# EAGLE schematic MicroMod_Multipurpose_CarrierBoard (EAGLE 9.6.2)

## Sheet 1 of 2
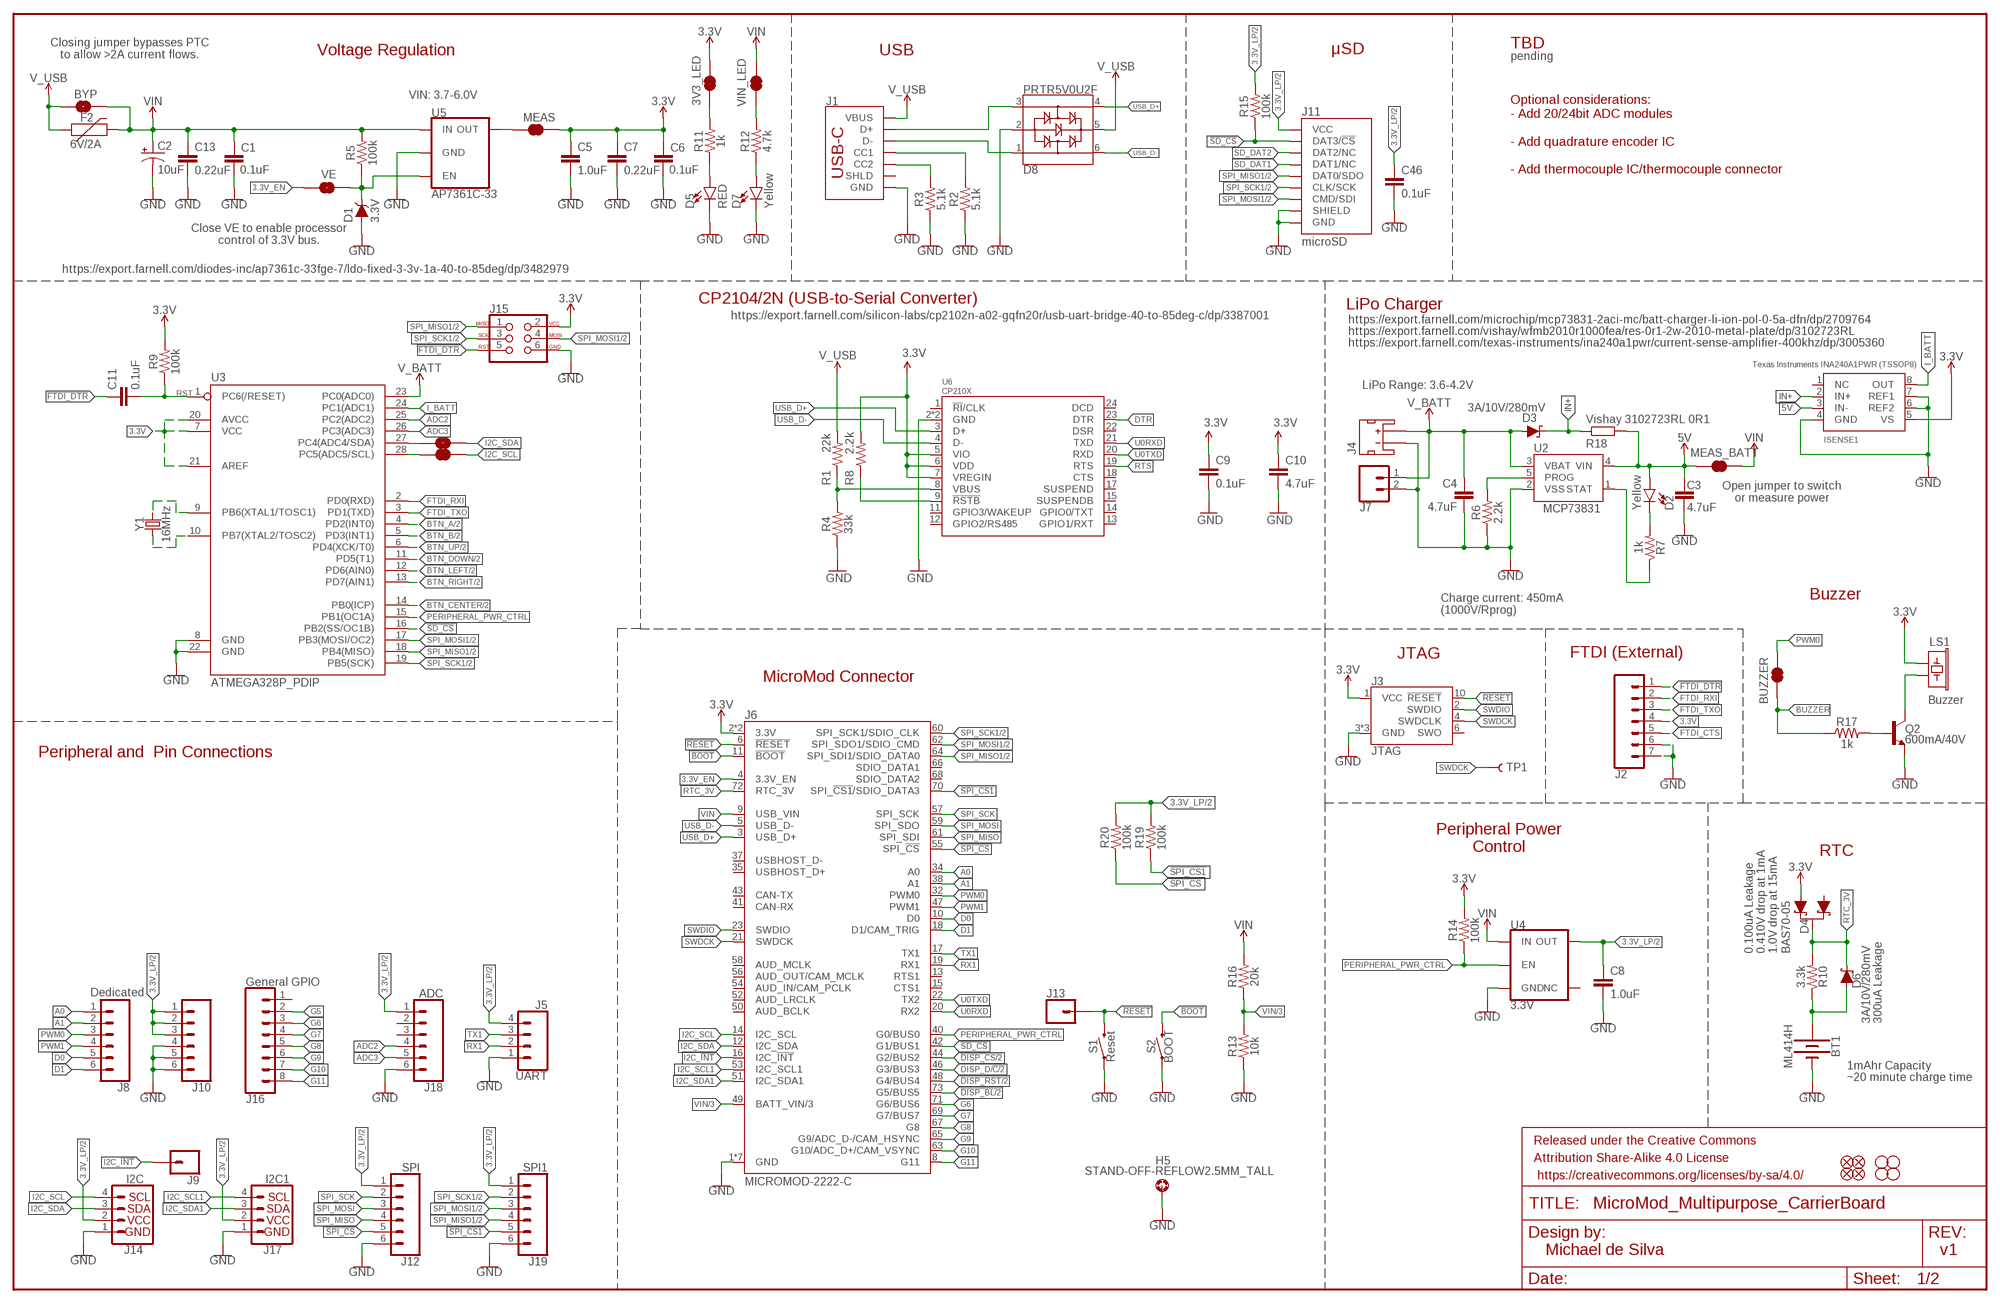
[diagram p0: schematic, sheet 1]

### Parts
3V3_LED  JUMPER-SMT_2_NC_TRACE_SILK  [SMT-JUMPER_2_NC_TRACE_SILK]
BT1  ML414H  ML414H_IV01E_BATTERY  [ML414H_IV01E]
BUZZER  JUMPER-COMBO_2_NC_TRACE  [COMBO-JUMPER_2_NC_TRACE]
BYP  JUMPER-SMT_2_NO_SILK  [SMT-JUMPER_2_NO_SILK]
C1  0.1uF  0.1UF-0603-25V-(+80/-20%)  [0603]
C2  10uF  10UF-POLAR-EIA3216-16V-10%(TANT)  [EIA3216]
C3  4.7uF  4.7UF-0603-35V-(20%)  [0603]
C4  4.7uF  4.7UF-0603-6.3V-(10%)  [0603]
C5  1.0uF  1.0UF-0603-16V-10%  [0603]
C6  0.1uF  0.1UF-0603-25V-(+80/-20%)  [0603]
C7  0.22uF  0.22UF-0603-25V-10%  [0603]
C8  1.0uF  1.0UF-0603-16V-10%  [0603]
C9  0.1uF  0.1UF-0402T-16V-10%  [0402-TIGHT]
C10  4.7uF  4.7UF-0402_TIGHT-6.3V-20%-X5R  [0402-TIGHT]
C11  0.1uF  0.1UF-0603-25V-5%  [0603]
C13  0.22uF  0.22UF-0603-25V-10%  [0603]
C46  0.1uF  0.1UF-0603-25V-(+80/-20%)  [0603]
D1  3.3V  DIODE-ZENER-MM3Z3V3T1G  [SOD-323]
D2  Yellow  LED-YELLOW0603  [LED-0603]
D3  3A/10V/280mV  DIODE-SCHOTTKY-BAT60A  [SOD-323]
D4  BAS70-05  DIODE-SCHOTTKY-DUAL  [SOT23-3]
D5  RED  LED-RED0603  [LED-0603]
D6  3A/10V/280mV  DIODE-SCHOTTKY-BAT60A  [SOD-323]
D7  Yellow  LED-YELLOW0603  [LED-0603]
D8  PRTR5V0U2F  [SOT886]
F2  6V/2A  PPTC_6V2A  [1210]
FD1  FIDUCIALUFIDUCIAL  [FIDUCIAL-MICRO]
FD2  FIDUCIALUFIDUCIAL  [FIDUCIAL-MICRO]
FD3  FIDUCIALUFIDUCIAL  [FIDUCIAL-MICRO]
FD4  FIDUCIALUFIDUCIAL  [FIDUCIAL-MICRO]
FRAME1  FRAME-LEDGER  [CREATIVE_COMMONS]
H1  STAND-OFF  [STAND-OFF]
H2  STAND-OFF  [STAND-OFF]
H3  STAND-OFF  [STAND-OFF]
H4  STAND-OFF  [STAND-OFF]
H5  STAND-OFF-REFLOW2.5MM_TALL  [STAND-OFF-REFLOW-M2.5]
I2C_SCL  JUMPER-COMBO_2_NC_TRACE  [COMBO-JUMPER_2_NC_TRACE]
I2C_SDA  JUMPER-COMBO_2_NC_TRACE  [COMBO-JUMPER_2_NC_TRACE]
ISENSE1  Texas Instruments INA240A1PWR (TSSOP8)  IN240ATSSOP8  [TSSOP8]
J1  USB_C_2-LAYER_PADS  [USB-C-16P-2LAYER-PADS]
J2  CONN_07  [1X07]
J3  JTAG  CORTEX_JTAG_DEBUG_MINIMUM_PTH  [2X5-PTH-1.27MM]
J4  JST_2MM_MALE  [JST-2-SMD]
J5  UART  CONN_041X04_NO_SILK  [1X04_NO_SILK]
J6  MICROMOD-2222-C  [M.2-CONNECTOR-E]
J7  CONN_021X02_NO_SILK  [1X02_NO_SILK]
J8  Dedicated  CONN_06NO_SILK_NO_POP  [1X06_NO_SILK]
J9  CONN_01PTH_NO_SILK_YES_STOP  [1X01_NO_SILK]
J10  CONN_06NO_SILK_NO_POP  [1X06_NO_SILK]
J11  microSD  MICRO-SD-SDIOPUSH-PUSH  [MICRO-SD-SOCKET]
J12  SPI  CONN_06NO_SILK_NO_POP  [1X06_NO_SILK]
J13  CONN_01PTH_NO_SILK_YES_STOP  [1X01_NO_SILK]
J14  I2C  I2C_STANDARD_NO_SILK  [1X04_NO_SILK]
J15  AVR_SPI_PROG_3X2TESTPOINTS  [2X3_TEST_POINTS]
J16  General GPIO  CONN_08"  [1X08]
J17  I2C1  I2C_STANDARD_NO_SILK  [1X04_NO_SILK]
J18  ADC  CONN_06NO_SILK_NO_POP  [1X06_NO_SILK]
J19  SPI1  CONN_06NO_SILK_NO_POP  [1X06_NO_SILK]
LS1  Buzzer  BUZZER-SMD  [BUZZER-CCV]
MEAS  JUMPER-COMBO_2_NC_TRACE  [COMBO-JUMPER_2_NC_TRACE]
MEAS_BATT  JUMPER-COMBO_2_NC_TRACE  [COMBO-JUMPER_2_NC_TRACE]
Q2  600mA/40V  TRANS_NPN-MMBT2222AL  [SOT23-3]
R1  22k  22KOHM-0402_TIGHT-1/10W-1%  [0402-TIGHT]
R2  5.1k  5.1KOHM5.1KOHM-0603-1/10W-1%  [0603]
R3  5.1k  5.1KOHM5.1KOHM-0603-1/10W-1%  [0603]
R4  33k  33KOHM-0402T-1/16W-1%  [0402-TIGHT]
R5  100k  100KOHM-0603-1/10W-1%  [0603]
R6  2.2k  2.2KOHM-0603-1/10W-1%  [0603]
R7  1k  1KOHM-0603-1/10W-1%  [0603]
R8  2.2k  2.2KOHM-0402T-1/16W-1%  [0402-TIGHT]
R9  100k  100KOHM-0603-1/10W-1%  [0603]
R10  3.3k  3.3KOHM-0603-1/10W-1%  [0603]
R11  1k  1KOHM-0603-1/10W-1%  [0603]
R12  4.7k  4.7KOHM-0603-1/10W-1%  [0603]
R13  10k  10KOHM-0603-1/10W-1%  [0603]
R14  100k  100KOHM-0603-1/10W-1%  [0603]
R15  100k  100KOHM-0603-1/10W-1%  [0603]
R16  20k  20KOHM-0603-1/10W-1%  [0603]
R17  1k  1KOHM-0603-1/10W-1%  [0603]
R18  Vishay 3102723RL 0R1  R-EU_R5025  [R5025]
R19  100k  100KOHM-0603-1/10W-1%  [0603]
R20  100k  100KOHM-0603-1/10W-1%  [0603]
S1  Reset  MOMENTARY-SWITCH-SPST-SMD-5.2-TALL-REDUNDANT  [TACTILE_SWITCH_SMD_5.2MM]
S2  BOOT  MOMENTARY-SWITCH-SPST-SMD-5.2-TALL-REDUNDANT  [TACTILE_SWITCH_SMD_5.2MM]
TP1  TEST-POINT3  [PAD.03X.03]
U2  MCP73831  [SOT23-5]
U3  ATMEGA328P_PDIP  [DIP28]
U4  3.3V  V_REG_AP2112K-3.3V  [SOT23-5]
U5  AP7361C-33  AP7361C-33FGEUDFN-8  [UDFN-8]
U6  CP210X  CP2102N  [QFN24]
VE  JUMPER-SMT_2_NO_SILK  [SMT-JUMPER_2_NO_SILK]
VIN_LED  JUMPER-SMT_2_NC_TRACE_SILK  [SMT-JUMPER_2_NC_TRACE_SILK]
Y1  16MHz  CRYSTAL-16MHZPTH-HC49US  [HC49US]

### Nets
3.3V: 3V3_LED.2 C5.1 C6.1 C7.1 C9.1 C10.1 D4.2(A1) ISENSE1.5(VS) J2.4 J3.1(VCC) J6.2(3.3V) J6.74(3.3V) J15.2 LS1.+ MEAS.2 MEAS.4 R8.2 R9.2 R14.2 U3.7(VCC) U3.20(AVCC) U3.21(AREF) U6.5(VIO) U6.6(VDD) U6.7(VREGIN) ; also sheet 2
3.3V_EN: J6.4(3.3V_EN) VE.1
3.3V_EN_VE: D1.C R5.1 U5.5(EN) VE.2
3.3V_LP: C8.1 C46.1 J5.4 J10.1 J10.2 J10.3 J11.VCC J12.1 J14.2 J17.2 J18.1 J19.1 R15.2 R19.2 R20.2 U4.5(OUT) ; also sheet 2
5V: C3.1 D2.A ISENSE1.3(IN-) MEAS_BATT.1 MEAS_BATT.3 R18.2 U2.4(VIN)
!BOOT!: J6.11(!BOOT!) S2.3 S2.4
!DISP_BL: J6.73(G5/BUS5) ; also sheet 2
!DISP_CS: J6.44(G2/BUS2) ; also sheet 2
!DISP_RST: J6.48(G4/BUS4) ; also sheet 2
!FTDI_DTR: C11.1 J2.1 J15.5
!RESET!: J3.10(!RESET) J6.6(!RESET!) J13.1 S1.3 S1.4
!SD_CS!: J6.42(G1/BUS1) J11.CS/DAT3(DAT3/!CS!) R15.1 U3.16(PB2(SS/OC1B))
!SPI_CS1!: J6.70(SPI_!CS1!/SDIO_DATA3) J19.5 R19.1
!SPI_CS!: J6.55(SPI_!CS!) J12.5 R20.1
A0: J6.34(A0) J8.1
A1: J6.38(A1) J8.2
ADC2: J18.4 U3.25(PC2(ADC2))
ADC3: J18.5 U3.26(PC3(ADC3))
BTN_A: U3.4(PD2(INT0)) ; also sheet 2
BTN_B: U3.5(PD3(INT1)) ; also sheet 2
BTN_CENTER: U3.14(PB0(ICP)) ; also sheet 2
BTN_DOWN: U3.11(PD5(T1)) ; also sheet 2
BTN_LEFT: U3.12(PD6(AIN0)) ; also sheet 2
BTN_RIGHT: U3.13(PD7(AIN1)) ; also sheet 2
BTN_UP: U3.6(PD4(XCK/T0)) ; also sheet 2
BUZZER: BUZZER.1 BUZZER.3 R17.1
CHG_LED: R7.1 U2.1(STAT)
D0: J6.10(D0) J8.5
D1: J6.18(D1/CAM_TRIG) J8.6
DISP_D/!C: J6.46(G3/BUS3) ; also sheet 2
DTR: U6.23(DTR)
FTDI_CTS: J2.5
FTDI_RXI: J2.2 U3.2(PD0(RXD))
FTDI_TXO: J2.3 U3.3(PD1(TXD))
G5: J16.2
G6: J6.71(G6/BUS6) J16.3
G7: J6.69(G7/BUS7) J16.4
G8: J6.67(G8) J16.5
G9: J6.65(G9/ADC_D-/CAM_HSYNC) J16.6
G10: J6.63(G10/ADC_D+/CAM_VSYNC) J16.7
G11: J6.8(G11) J16.8
GND: BT1.- C1.2 C2.- C3.2 C4.2 C5.2 C6.2 C7.2 C8.2 C9.2 C10.2 C13.2 C46.2 D1.A D5.C D7.C D8.2 H5.1 ISENSE1.4(GND) ISENSE1.6(REF2) ISENSE1.7(REF1) J1.GND J1.GND2(GND) J2.6 J2.7 J3.3(GND) J3.5(GND) J3.9(GND) J4.1(-) J5.1 J6.1(GND) J6.7(GND) J6.33(GND) J6.36(GND) J6.39(GND) J6.45(GND) J6.75(GND) J7.2 J10.4 J10.5 J10.6 J11.CD1(SHIELD) J11.GND J11.GND1(GND) J11.GND3(GND) J12.6 J14.1 J15.6 J17.1 J18.6 J19.6 Q2.2(E) R2.1 R3.1 R4.1 R6.1 R13.1 S1.1 S1.2 S2.1 S2.2 U2.2(VSS) U3.8(GND) U3.22(GND) U4.2(GND) U5.4(GND) U5.EP(GND) U6.2(GND) U6.PAD(GND) ; also sheet 2
I2C_!INT!: J6.16(I2C_!INT!) J9.1
I2C_SCL: I2C_SCL.1 I2C_SCL.3 J6.14(I2C_SCL) J14.4
I2C_SCL1: J6.53(I2C_SCL1) J17.4
I2C_SDA: I2C_SDA.2 I2C_SDA.4 J6.12(I2C_SDA) J14.3
I2C_SDA1: J6.51(I2C_SDA1) J17.3
I_BATT: ISENSE1.8(OUT) U3.24(PC1(ADC1))
IN+: D3.C ISENSE1.2(IN+) R18.1
N$1: MEAS.1 MEAS.3 U5.1(OUT)
N$2: U3.9(PB6(XTAL1/TOSC1)) Y1.2
N$3: U3.10(PB7(XTAL2/TOSC2)) Y1.1
N$4: D2.C R7.2
N$5: D5.A R11.1
N$6: 3V3_LED.1 R11.2
N$7: R6.2 U2.5(PROG)
N$8: R12.2 VIN_LED.1
N$9: D7.A R12.1
N$10: J1.A5(CC1) R2.2
N$11: J1.B5(CC2) R3.2
N$12: R1.1 R4.2 U6.8(VBUS)
N$13: R8.1 U6.9(!RSTB)
N$14: BT1.+ D6.A R10.1
N$15: LS1.- Q2.3(C)
N$16: Q2.1(B) R17.2
N$17: I2C_SDA.1 I2C_SDA.3 U3.27(PC4(ADC4/SDA))
N$18: I2C_SCL.2 I2C_SCL.4 U3.28(PC5(ADC5/SCL))
N$23: D8.1 J1.A7(D-) J1.B7(D-)
N$24: D8.3 J1.A6(D+) J1.B6(D+)
PERIPHERAL_PWR_CTRL: J6.40(G0/BUS0) R14.1 U3.15(PB1(OC1A)) U4.3(EN)
PWM0: BUZZER.2 BUZZER.4 J6.32(PWM0) J8.3
PWM1: J6.47(PWM1) J8.4
RST: C11.2 R9.1 U3.1(PC6(/RESET))
RTC_3V: D4.3(C) D6.C J6.72(RTC_3V) R10.2
RTS: U6.19(RTS)
RX1: J5.2 J6.19(RX1)
SD_DAT1: J11.DAT1(DAT1/NC)
SD_DAT2: J11.DAT2(DAT2/NC)
SPI_MISO: J6.61(SPI_SDI) J12.4
SPI_MISO1: J6.64(SPI_SDI1/SDIO_DATA0) J11.DO/DAT0(DAT0/SDO) J15.1 J19.4 U3.18(PB4(MISO)) ; also sheet 2
SPI_MOSI: J6.59(SPI_SDO) J12.3
SPI_MOSI1: J6.62(SPI_SDO1/SDIO_CMD) J11.DI/CMD(CMD/SDI) J15.4 J19.3 U3.17(PB3(MOSI/OC2)) ; also sheet 2
SPI_SCK: J6.57(SPI_SCK) J12.2
SPI_SCK1: J6.60(SPI_SCK1/SDIO_CLK) J11.SCLK(CLK/SCK) J15.3 J19.2 U3.19(PB5(SCK)) ; also sheet 2
SWDCK: J3.4(SWDCLK) J6.21(SWDCK) TP1.P$1
SWDIO: J3.2(SWDIO) J6.23(SWDIO)
TX1: J5.3 J6.17(TX1)
U0RXD: J6.20(RX2) U6.21(TXD)
U0TXD: J6.22(TX2) U6.20(RXD)
USB_D+: D8.4 J6.3(USB_D+) U6.3(D+)
USB_D-: D8.6 J6.5(USB_D-) U6.4(D-)
V_BATT: C4.1 D3.A J4.2(+) J7.1 U2.3(VBAT) U3.23(PC0(ADC0))
V_USB: BYP.1 D8.5 F2.1 J1.VBUS1(VBUS) J1.VBUS2(VBUS) R1.2
VIN: BYP.2 C1.1 C2.+ C13.1 F2.2 J6.9(USB_VIN) MEAS_BATT.2 MEAS_BATT.4 R5.2 R16.2 U4.1(IN) U5.8(IN) VIN_LED.2
VIN/3: J6.49(BATT_VIN/3) R13.2 R16.1
Unconnected: D4.1(A) ISENSE1.1(NC) J1.SHLD1(SHLD) J1.SHLD2(SHLD) J1.SHLD3(SHLD) J1.SHLD4(SHLD) J3.6(SWO) J4.NC1(PAD1) J4.NC2(PAD2) J6.13(RTS1) J6.15(CTS1) J6.35(USBHOST_D+) J6.37(USBHOST_D-) J6.41(CAN-RX) J6.43(CAN-TX) J6.50(AUD_BCLK) J6.52(AUD_LRCLK) J6.54(AUD_IN/CAM_PCLK) J6.56(AUD_OUT/CAM_MCLK) J6.58(AUD_MCLK) J6.66(SDIO_DATA1) J6.68(SDIO_DATA2) J16.1 J18.2 J18.3 U4.4(NC) U6.1(!RI!/CLK) U6.11(GPIO3/WAKEUP) U6.12(GPIO2/RS485) U6.13(GPIO1/RXT) U6.14(GPIO0/TXT) U6.15(SUSPENDB) U6.17(SUSPEND) U6.18(CTS) U6.22(DSR) U6.24(DCD)

### Notes on the sheet
- Closing jumper bypasses PTC
  to allow >2A current flows.
- Voltage Regulation | USB | μSD | TBD
- pending
- VIN: 3.7-6.0V
- Optional considerations:
  - Add 20/24bit ADC modules
  
  - Add quadrature encoder IC
  
  - Add thermocouple IC/thermocouple connector
- Close VE to enable processor
  control of 3.3V bus.
- https://export.farnell.com/diodes-inc/ap7361c-33fge-7/ldo-fixed-3-3v-1a-40-to-85deg/dp/3482979
- CP2104/2N (USB-to-Serial Converter) | LiPo Charger
- https://export.farnell.com/silicon-labs/cp2102n-a02-gqfn20r/usb-uart-bridge-40-to-85deg-c/dp/3387001 | https://export.farnell.com/microchip/mcp73831-2aci-mc/batt-charger-li-ion-pol-0-5a-dfn/dp/2709764
- https://export.farnell.com/vishay/wfmb2010r1000fea/res-0r1-2w-2010-metal-plate/dp/3102723RL
- https://export.farnell.com/texas-instruments/ina240a1pwr/current-sense-amplifier-400khz/dp/3005360
- LiPo Range: 3.6-4.2V
- Open jumper to switch
  or measure power
- Charge current: 450mA
  (1000V/Rprog)
- Buzzer
- JTAG | FTDI (External)
- MicroMod Connector
- Peripheral and  Pin Connections
- Peripheral Power
  Control
- RTC
- 0.100uA Leakage
  0.410V drop at 1mA
  1.0V drop at 15mA
- 300uA Leakage
- 1mAhr Capacity
- ~20 minute charge time
- Michael de Silva | v1

## Sheet 2 of 2
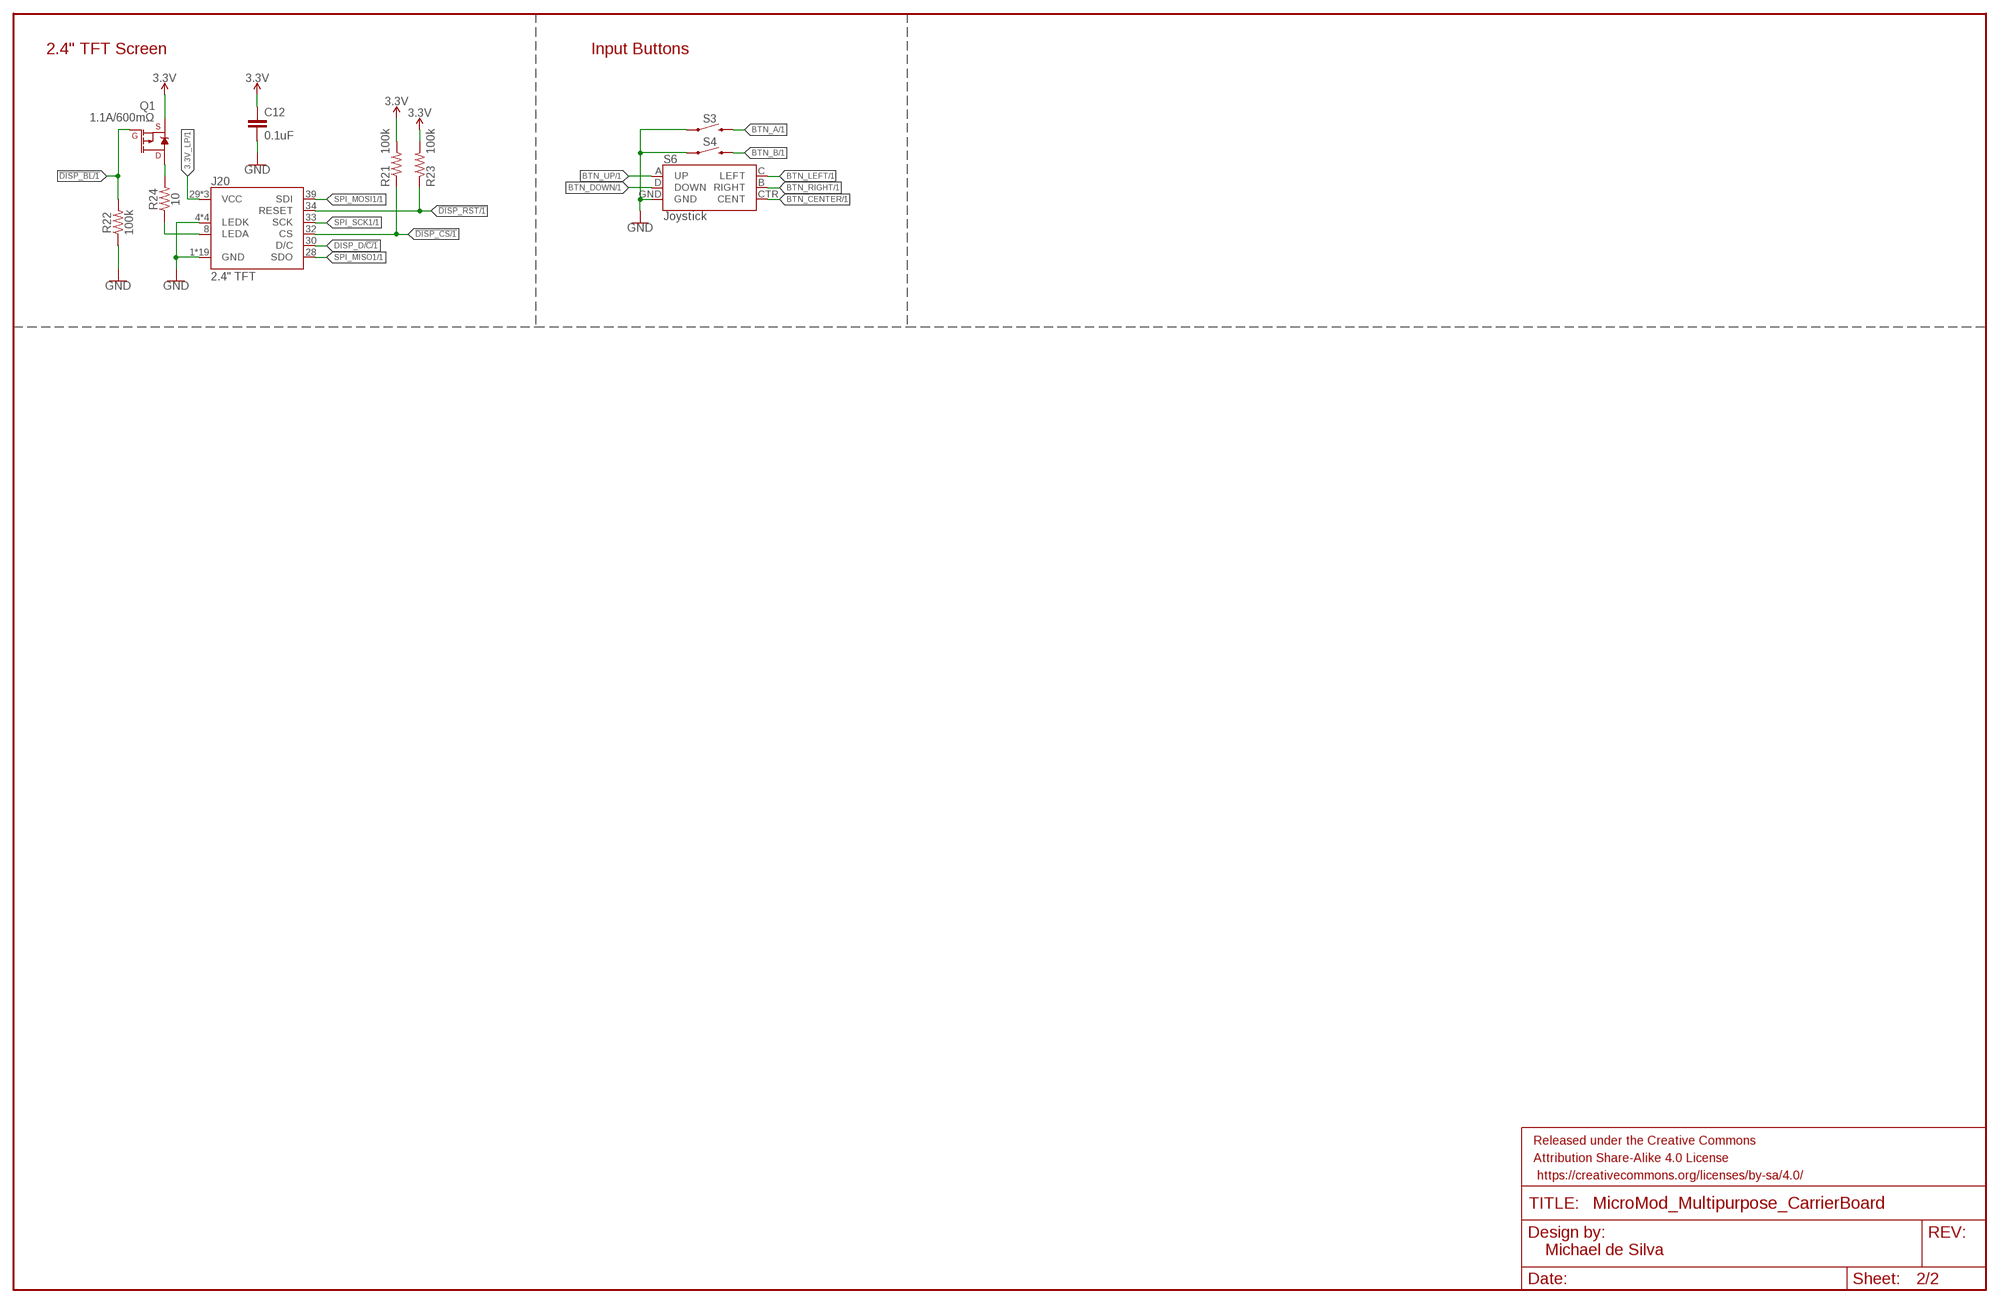
[diagram p1: schematic, sheet 2]

### Parts
C12  0.1uF  0.1UF-0603-25V-(+80/-20%)  [0603]
FRAME2  FRAME-LEDGER  [CREATIVE_COMMONS]
J20  2.4" TFT  4DLCD-24-320X240  [FPC05040-17204]
Q1  1.1A/600mΩ  MOSFET_PCH-SI2309DS  [SOT23-3]
R21  100k  100KOHM-0603-1/10W-1%  [0603]
R22  100k  100KOHM-0603-1/10W-1%  [0603]
R23  100k  100KOHM-0603-1/10W-1%  [0603]
R24  10  10OHM-1206-1/4W-1%  [1206]
S3  MOMENTARY-SWITCH-SPST-SMD-5.2MM-TALL  [TACTILE_SWITCH_SMD_5.2MM]
S4  MOMENTARY-SWITCH-SPST-SMD-5.2MM-TALL  [TACTILE_SWITCH_SMD_5.2MM]
S6  Joystick  JOYSTICK_MINI  [JOYSTICK_MINI]

### Nets
3.3V: C12.1 Q1.2(S) R21.2 R23.2 ; also sheet 1
3.3V_LP: J20.29(VCC) J20.31(VCC) J20.38(VCC) ; also sheet 1
!DISP_BL: Q1.1(G) R22.2 ; also sheet 1
!DISP_CS: J20.32(CS) R21.1 ; also sheet 1
!DISP_RST: J20.34(RESET) R23.1 ; also sheet 1
BTN_A: S3.3 ; also sheet 1
BTN_B: S4.3 ; also sheet 1
BTN_CENTER: S6.CTR(CENT) ; also sheet 1
BTN_DOWN: S6.D(DOWN) ; also sheet 1
BTN_LEFT: S6.C(LEFT) ; also sheet 1
BTN_RIGHT: S6.B(RIGHT) ; also sheet 1
BTN_UP: S6.A(UP) ; also sheet 1
DISP_D/!C: J20.30(D/C) ; also sheet 1
GND: C12.2 J20.1(GND) J20.4(LEDK) J20.5(LEDK) J20.6(LEDK) J20.7(LEDK) J20.11(GND) J20.12(GND) J20.13(GND) J20.14(GND) J20.15(GND) J20.16(GND) J20.17(GND) J20.18(GND) J20.19(GND) J20.20(GND) J20.21(GND) J20.22(GND) J20.23(GND) J20.24(GND) J20.25(GND) J20.26(GND) J20.27(GND) J20.40(GND) R22.1 S3.1 S4.1 S6.GND ; also sheet 1
N$19: J20.8(LEDA) R24.1
N$20: Q1.3(D) R24.2
SPI_MISO1: J20.28(SDO) ; also sheet 1
SPI_MOSI1: J20.39(SDI) ; also sheet 1
SPI_SCK1: J20.33(SCK) ; also sheet 1

### Notes on the sheet
- 2.4" TFT Screen | Input Buttons
- Michael de Silva

## Library data of the parts
3V3_LED VIN_LED = SparkFun-Jumpers:JUMPER-SMT_2_NC_TRACE: Normally closed trace jumper This jumper has a trace between two pads so it's normally closed (NC). Use a razor knife to open the connection. For best results follow the IPC guidelines for cutting traces: Cutout at least 0.063 mm (0.005 in). Remove all loose material to clean up the cut area. Seal the cut with an approved epoxy. Reapply solder to reclose the connection.
BT1 = SparkFun-Batteries:ML414H_IV01E_BATTERY: SEIKO ML414H-IV01E Reflowable Lithium Battery ML414H is a rechargeable, coin type battery with features such as Pb-free reflowable (Peak temperature: 260 C) and high temperature heat resistance. Battery Characteristics: 3.1V max voltage Voff is 2V 1mAH 3k series resistor with battery 72 hour charge time from 2.0-3.1V 2.3-2.8V initial charge; PROD_ID: BATT-14267
BUZZER I2C_SCL I2C_SDA MEAS MEAS_BATT = SparkFun-Jumpers:JUMPER-COMBO_2_NC_TRACE
BYP VE = SparkFun-Jumpers:JUMPER-SMT_2_NO: Normally open jumper This jumper has two pads in close proximity to each other. Apply solder to close the connection. Round pads are easier to solder for beginners, but are a lot larger. SparkFun Product that uses the round pads: SparkFun EL Sequencer <https://www.sparkfun.com/products/12781>
C1 C6 C12 C46 = SparkFun-Capacitors:0.1UF: 0.1µF ceramic capacitors A capacitor is a passive two-terminal electrical component used to store electrical energy temporarily in an electric field.; PROD_ID: CAP-00810
C2 = SparkFun-Capacitors:10UF-POLAR: 10.0µF polarized capacitors A capacitor is a passive two-terminal electrical component used to store electrical energy temporarily in an electric field.; PROD_ID: CAP-00811
C3 = SparkFun-Capacitors:4.7UF: 4.7µF ceramic capacitors A capacitor is a passive two-terminal electrical component used to store electrical energy temporarily in an electric field.; PROD_ID: CAP-14106
C4 = SparkFun-Capacitors:4.7UF: 4.7µF ceramic capacitors A capacitor is a passive two-terminal electrical component used to store electrical energy temporarily in an electric field.; PROD_ID: CAP-08280
C5 C8 = SparkFun-Capacitors:1.0UF: 1µF ceramic capacitors A capacitor is a passive two-terminal electrical component used to store electrical energy temporarily in an electric field.; PROD_ID: CAP-00868
C7 C13 = SparkFun-Capacitors:0.22UF: 0.22µF ceramic capacitors A capacitor is a passive two-terminal electrical component used to store electrical energy temporarily in an electric field.; PROD_ID: CAP-07822
C9 = SparkFun-Capacitors:0.1UF: 0.1µF ceramic capacitors A capacitor is a passive two-terminal electrical component used to store electrical energy temporarily in an electric field.; PROD_ID: CAP-12416
C10 = SparkFun-Capacitors:4.7UF: 4.7µF ceramic capacitors A capacitor is a passive two-terminal electrical component used to store electrical energy temporarily in an electric field.; PROD_ID: CAP-14240
C11 = SparkFun-Capacitors:0.1UF: 0.1µF ceramic capacitors A capacitor is a passive two-terminal electrical component used to store electrical energy temporarily in an electric field.; PROD_ID: CAP-08604
D1 = SparkFun-DiscreteSemi:DIODE-ZENER: Zener Diode A Zener diode allows current to flow from its anode to its cathode like a normal semiconductor diode, but it also permits current to flow in the reverse direction when its "Zener voltage" is reached. - WIkipedia; PROD_ID: DIO-11284
D2 D7 = SparkFun-LED:LED-YELLOW: Yellow SMD LED Used in manufacturing several products at SparkFun. Packages: 0603 - SMD 0603 package[Product Link] <http://www.kingbrightusa.com/product.asp?catalog_name=LED&product_id=APT1608SYCK> 0603 -SMART - SMART SMD 0603 package (more efficient/more expensive) [Product Link] <http://www.osram-os.com/osram_os/en/products/product-catalog/led-light-emitting-diodes/smartled-0603/ly-l29k/index.jsp> LilyPad - SMD1206 package[Product Datasheet] <https://www.sparkfun.com/datasheets/DevTools/LilyPad/Q150YUS4.pdf> SparkFun Products: Blynk Board <https://www.sparkfun.com/products/13794> IOIO-OTG <https://www.sparkfun.com/products/13613> XBee Explorer Serial <https://www.sparkfun.com/products/13225>; PROD_ID: DIO-09003
D3 D6 = SparkFun-DiscreteSemi:DIODE-SCHOTTKY: Schottky diode A Schottky diode is a semiconductor diode which has a low forward voltage drop and a very fast switching action.; PROD_ID: DIO-14072
D4 = SparkFun-DiscreteSemi:DIODE-SCHOTTKY-DUAL: Diodes Incorporated - BAS70-05 Dual Schottky Diode Two Schottky Diodes in a single SOT-23 package. Low reverse current (100 nA) Vf: Datasheet referenced for footprint <https://www.diodes.com/assets/Datasheets/ds11007.pdf>; PROD_ID: DIO-14829
D5 = SparkFun-LED:LED-RED: Red SMD LED Used in manufacturing of most products at SparkFun Packages: 0603 - SMD 0603 package [Product Link] <http://docs.avagotech.com/docs/AV02-0551EN> 0603 SMART - SMD 0603 SMART package ( more efficient and expensive)[Product Link] <http://www.osram-os.com/Graphics/XPic2/00077099_0.pdf> 1206 - SMD1206 package [Product Link] <https://www.sparkfun.com/datasheets/DevTools/LilyPad/Q150OVS4.pdff> SparkFun Products: Pro Mini 328 -5V <https://www.sparkfun.com/products/821> RedBoard <https://www.sparkfun.com/products/12757> IOIO-OTG <https://www.sparkfun.com/products/13613>; PROD_ID: DIO-00819
D8 = SparkFun-IC-Power:PRTR5V0U2: A small ESD protection device. Most commonly used on USB D+/D- signals to protect large, expensive, or especially sensitive USB enabled devices.; PROD_ID: DIO-14084
F2 = SparkFun-Fuses:PPTC: Resettable Fuse PPTC Resettable Fuse. Really a sort of resistor with a polymeric positive temperature coefficient whose resistance increases dramatically with an increase in temperature. When heated by the power passing through the resistance rises causing the current to be limited, protecting the circuit. This is achieved by the transition of the polymer from a crystalline to an amorphous state where the conductive carbon separates breaking the conductive pathways found in the cool crystalline structure. When a PPTC cools back down it resumes conducting letting the circuit turn back on. SparkFun Products: SparkFun RedBoard - Programmed with Arduino <https://www.sparkfun.com/products/12757> Pro Micro - 5V/16MHz <https://www.sparkfun.com/products/12640> Arduino Pro 328 - 5V/16MHz <https://www.sparkfun.com/products/10915> MP3 Trigger <https://www.sparkfun.com/products/13720>; PROD_ID: RES-14313
FD1-FD4 = SparkFun-Aesthetics:FIDUCIAL: Fiducial Alignment Points Point-of-reference for pick-and-place machines and other optical instruments.
FRAME1 FRAME2 = SparkFun-Aesthetics:FRAME-LEDGER: Schematic Frame - Ledger Standard 11x14 US Ledger frame
H1-H4 = SparkFun-Hardware:STAND-OFF: Stand Off Drill holes for mechanically mounting via screws, standoffs, etc. Note: Use the keepout ring to avoid running the screw head into surrounding components. Variant Overviews STAND-OFF - Mechanical footprint for a #4 phillips button head screw. STAND-OFF-TIGHT - Mechanical footprint for a #4 phillips button head screw, Example SparkFun Products Screw - Phillips Head (1/4", 4-40, 10 pack) <https://www.sparkfun.com/products/10453> (PRT-10453) Screw - Phillips Head (1/2", 4-40, 10 pack) <https://www.sparkfun.com/products/10452> (PRT-10452) Screw - Phillips Head (3/4", 4-40, 10 pack) <https://www.sparkfun.com/products/10451> (PRT-10451) Screw - Phillips Head (1", 4-40, 10 pack) <https://www.sparkfun.com/products/10450> (PRT-10450)
H5 = SparkFun-Hardware:STAND-OFF-REFLOW: Stand Off Reflow Compatible A metal standoff that can be placed and reflowed onto a PCB.; PROD_ID: HW-14899
ISENSE1 = bsodmike-Eagle-Libraries:IN240A
J1 = SparkFun-Connectors:USB_C: USB Type C 16Pin Connector Super Speed pins not available on the 16-pin purely SMD connector so this part is best for USB 2.0 implementations. D1 and D2 are tied together enabling D+/- no matter which way the cable is plugged into the connector. The two channel configuration pins (CC1/2) are exposed. These are normally connected to ground via 5.1k resistors but can be reconfigured for high current/high power applications.; PROD_ID: CONN-14122
J2 = SparkFun-Connectors:CONN_07: Multi connection point. Often used as Generic Header-pin footprint for 0.1 inch spaced/style header connections On any of the 0.1 inch spaced packages, you can populate with these: Break Away Headers - Straight <https://www.sparkfun.com/products/116> (PRT-00116) Break Away Male Headers - Right Angle <https://www.sparkfun.com/products/553> (PRT-00553) Female Headers <https://www.sparkfun.com/products/115> (PRT-00115) Break Away Headers - Machine Pin <https://www.sparkfun.com/products/117> (PRT-00117) Break Away Female Headers - Swiss Machine Pin <https://www.sparkfun.com/products/743> (PRT-00743) For SCREWTERMINALS and SPRING TERMINALS visit here: Screw Terimnals on SparkFun.com <https://www.sparkfun.com/search/results?term=Screw+Terminals> (5mm/3.5mm/2.54mm spacing) This device is also useful as a general connection point to wire up your design to another part of your project. Our various solder wires solder well into these plated through hole pads. Hook-Up Wire - Assortment (Stranded, 22 AWG) <https://www.sparkfun.com/products/11375> (PRT-11375) Hook-Up Wire - Assortment (Solid Core, 22 AWG) <https://www.sparkfun.com/products/11367> (PRT-11367) View the entire wire category on our website here <https://www.sparkfun.com/categories/141> Special notes: Molex polarized connector foot print use with SKU : PRT-08231 with associated crimp pins and housings. 1MM SMD Version SKU: PRT-10208 NOTES ON THE VARIANTS LOCK and LOCK_LONGPADS... This footprint was designed to help hold the alignment of a through-hole component (i.e. 6-pin header) while soldering it into place. You may notice that each hole has been shifted either up or down by 0.005 of an inch from it's more standard position (which is a perfectly straight line). This slight alteration caused the pins (the squares in the middle) to touch the edges of the holes. Because they are alternating, it causes a "brace" to hold the component in place. 0.005 has proven to be the perfect amount of "off-center" position when using our standard breakaway headers. Although looks a little odd when you look at the bare footprint, once you have a header in there, the alteration is very hard to notice. Also,if you push a header all the way into place, it is covered up entirely on the bottom side.
J3 = SparkFun-Connectors:CORTEX_JTAG_DEBUG_MINIMUM: Cortex Debug Connector - 10 pin Supports JTAG debug, Serial Wire debug, and Serial Wire Viewer. PTH and SMD connector options available. General Connector Information <http://infocenter.arm.com/help/topic/com.arm.doc.faqs/attached/13634/cortex_debug_connectors.pdf> Products: PTH Connector <http://www.digikey.com/product-detail/en/cnc-tech/3220-10-0100-00/1175-1627-ND/3883661> -via Digi-Key SparkFun PSoc <https://www.sparkfun.com/products/13229> SparkFun T <https://www.sparkfun.com/products/13810>
J4 = SparkFun-Connectors:JST_2MM_MALE: JST 2MM MALE RA CONNECTOR Two pin, compact surface mount connector. Commonly used as a battery input connection point. We really like the solid locking feeling and high current rating on these small connectors. We use these all the time as battery connectors. Mates to single-cell LiPo batteries. Here is the connector we sell at SparkFun: JST Right Angle Connector - White <https://www.sparkfun.com/products/8612> (PRT-08612) Datasheet <http://www.sparkfun.com/datasheets/Prototyping/Connectors/JST-Horizontal.pdf> It was used on these SparkFun products: SparkFun MOSFET Power Controller <https://www.sparkfun.com/products/11214> (PRT-11214) SparkFun Battery Babysitter - LiPo Battery Manager <https://www.sparkfun.com/products/13777> (PRT-13777) And many, many others that required a lipo battery connection.; PROD_ID: CONN-11443; SF_ID: PRT-08612
J5 = SparkFun-Connectors:CONN_04: Multi connection point. Often used as Generic Header-pin footprint for 0.1 inch spaced/style header connections On any of the 0.1 inch spaced packages, you can populate with these: Break Away Headers - Straight <https://www.sparkfun.com/products/116> (PRT-00116) Break Away Male Headers - Right Angle <https://www.sparkfun.com/products/553> (PRT-00553) Female Headers <https://www.sparkfun.com/products/115> (PRT-00115) Break Away Headers - Machine Pin <https://www.sparkfun.com/products/117> (PRT-00117) Break Away Female Headers - Swiss Machine Pin <https://www.sparkfun.com/products/743> (PRT-00743) For SCREWTERMINALS and SPRING TERMINALS visit here: Screw Terimnals on SparkFun.com <https://www.sparkfun.com/search/results?term=Screw+Terminals> (5mm/3.5mm/2.54mm spacing) This device is also useful as a general connection point to wire up your design to another part of your project. Our various solder wires solder well into these plated through hole pads. Hook-Up Wire - Assortment (Stranded, 22 AWG) <https://www.sparkfun.com/products/11375> (PRT-11375) Hook-Up Wire - Assortment (Solid Core, 22 AWG) <https://www.sparkfun.com/products/11367> (PRT-11367) View the entire wire category on our website here <https://www.sparkfun.com/categories/141> Special notes: Molex polarized connector foot print use with SKU : PRT-08231 with associated crimp pins and housings. 1MM SMD Version SKU: PRT-10208; PROD_ID: CONN-09696
J6 = SparkFun-MicroMod:MICROMOD: MicroMod Connector Description: A card edge connector and mating PCB connector to allow various MicroMod Processor Boards to be coupled with various carrier boards of different capabilities. Based on the M.2 standard.; PROD_ID: CONN-14877
J7 = SparkFun-Connectors:CONN_02: Multi connection point. Often used as Generic Header-pin footprint for 0.1 inch spaced/style header connections On any of the 0.1 inch spaced packages, you can populate with these: Break Away Headers - Straight <https://www.sparkfun.com/products/116> (PRT-00116) Break Away Male Headers - Right Angle <https://www.sparkfun.com/products/553> (PRT-00553) Female Headers <https://www.sparkfun.com/products/115> (PRT-00115) Break Away Headers - Machine Pin <https://www.sparkfun.com/products/117> (PRT-00117) Break Away Female Headers - Swiss Machine Pin <https://www.sparkfun.com/products/743> (PRT-00743) For SCREWTERMINALS and SPRING TERMINALS visit here: Screw Terimnals on SparkFun.com <https://www.sparkfun.com/search/results?term=Screw+Terminals> (5mm/3.5mm/2.54mm spacing) This device is also useful as a general connection point to wire up your design to another part of your project. Our various solder wires solder well into these plated through hole pads. Hook-Up Wire - Assortment (Stranded, 22 AWG) <https://www.sparkfun.com/products/11375> (PRT-11375) Hook-Up Wire - Assortment (Solid Core, 22 AWG) <https://www.sparkfun.com/products/11367> (PRT-11367) View the entire wire category on our website here <https://www.sparkfun.com/categories/141> Special notes: Molex polarized connector foot print use with: PRT-08233 with associated crimp pins and housings. 2.54_SCREWTERM for use with PRT-10571. 3.5mm Screw Terminal footprints for PRT-08084 5mm Screw Terminal footprints for use with PRT-08432
J8 J10 J12 J18 J19 = SparkFun-Connectors:CONN_06: Multi connection point. Often used as Generic Header-pin footprint for 0.1 inch spaced/style header connections On any of the 0.1 inch spaced packages, you can populate with these: Break Away Headers - Straight <https://www.sparkfun.com/products/116> (PRT-00116) Break Away Male Headers - Right Angle <https://www.sparkfun.com/products/553> (PRT-00553) Female Headers <https://www.sparkfun.com/products/115> (PRT-00115) Break Away Headers - Machine Pin <https://www.sparkfun.com/products/117> (PRT-00117) Break Away Female Headers - Swiss Machine Pin <https://www.sparkfun.com/products/743> (PRT-00743) Arduino Stackable Header - 6 Pin <https://www.sparkfun.com/products/9280> (PRT-09280) For SCREWTERMINALS and SPRING TERMINALS visit here: Screw Terimnals on SparkFun.com <https://www.sparkfun.com/search/results?term=Screw+Terminals> (5mm/3.5mm/2.54mm spacing) This device is also useful as a general connection point to wire up your design to another part of your project. Our various solder wires solder well into these plated through hole pads. Hook-Up Wire - Assortment (Stranded, 22 AWG) <https://www.sparkfun.com/products/11375> (PRT-11375) Hook-Up Wire - Assortment (Solid Core, 22 AWG) <https://www.sparkfun.com/products/11367> (PRT-11367) View the entire wire category on our website here <https://www.sparkfun.com/categories/141>
J9 J13 = SparkFun-Connectors:CONN_01: Single connection point. Often used as Generic Header-pin footprint for 0.1 inch spaced/style header connections On any of the 0.1 inch spaced packages, you can populate with these: Break Away Headers - Straight <https://www.sparkfun.com/products/116> (PRT-00116) Break Away Male Headers - Right Angle <https://www.sparkfun.com/products/553> (PRT-00553) Female Headers <https://www.sparkfun.com/products/115> (PRT-00115) Break Away Headers - Machine Pin <https://www.sparkfun.com/products/117> (PRT-00117) Break Away Female Headers - Swiss Machine Pin <https://www.sparkfun.com/products/743> (PRT-00743) This device is also useful as a general connection point to wire up your design to another part of your project. Our various solder wires solder well into these plated through hole pads. Hook-Up Wire - Assortment (Stranded, 22 AWG) <https://www.sparkfun.com/products/11375> (PRT-11375) Hook-Up Wire - Assortment (Solid Core, 22 AWG) <https://www.sparkfun.com/products/11367> (PRT-11367) View the entire wire category on our website here <https://www.sparkfun.com/categories/141> Special notes: SMTSO-256-ET is a "flush mount" nut for a 4-40 screw. We mostly use this on specialty testbeds; it is a nice way to connect hardware to your PCB at an adjustable hieght. Also note, the SNAP packages are for using a snappable style connector. We sell a baggie of snaps and they are also used on two LilyPad designs: Snap Assortment - 30 pack (male and female) <https://www.sparkfun.com/products/11347> (DEV-11347) LilyPad Arduino SimpleSnap <https://www.sparkfun.com/products/10941> (DEV-10941) LilyPad SimpleSnap Protoboard <https://www.sparkfun.com/products/10940> (DEV-10940)
J11 = SparkFun-Connectors:MICRO-SD-SDIO: microSD Socket for Transflash Push-push type µSD socket. tDoc lines correctly indicate media card edge positions when inserting (unlocked, locked, depressed). NOTE: CD1 and CD2 are connected internally, and the default detect state of the socket is detect pin to ground. SparkFun Products: WAV Trigger <https://www.sparkfun.com/products/13660> CAN-Bus Shield <https://www.sparkfun.com/products/13262> SparkFun Level Shifing microSD Breakout <https://www.sparkfun.com/products/13743>; PROD_ID: CONN-07820
J14 J17 = SparkFun-Connectors:I2C_STANDARD: SparkFun I2C Standard Pinout Header SparkFun has standardized on a pinout for all I2C based sensor breakouts. This pinout allows I2C boards to be plugged directly into the headers on Arduino Uno compatible boards, and to be daisy chained easily. Example SparkFun Products: SparkFun Atmospheric Sensor Breakout - BME280 <https://www.sparkfun.com/products/13676> SparkFun Altitude/Pressure Sensor Breakout - MPL3115A2 <https://www.sparkfun.com/products/11084> SparkFun TOF Range Finder Sensor - VL6180 <https://www.sparkfun.com/products/12785>
J15 = SparkFun-Connectors:AVR_SPI_PROG_3X2: AVR ISP 6 Pin This is the reduced ISP connector for AVR programming. Common on Arduino. This footprint will take up less PCB space and can be used with a 10-pin to 6-pin adapter such as SKU: BOB-08508 **Special note about "TEST_POINT" package. The stop mask is on the top side, so if you want your programming test points to be on the bottom of your board, make sure to place this package on the bottom side of the board. This also ensure that the orientation to program from the bottom side will be correct. SparkFun Products: SparkFun ISP Pogo Adapter <https://www.sparkfun.com/products/11591> - NS Tiny AVR Programmer <https://www.sparkfun.com/products/11801> -PTH
J16 = SparkFun-Connectors:CONN_08: Multi connection point. Often used as Generic Header-pin footprint for 0.1 inch spaced/style header connections On any of the 0.1 inch spaced packages, you can populate with these: Break Away Headers - Straight <https://www.sparkfun.com/products/116> (PRT-00116) Break Away Male Headers - Right Angle <https://www.sparkfun.com/products/553> (PRT-00553) Female Headers <https://www.sparkfun.com/products/115> (PRT-00115) Break Away Headers - Machine Pin <https://www.sparkfun.com/products/117> (PRT-00117) Break Away Female Headers - Swiss Machine Pin <https://www.sparkfun.com/products/743> (PRT-00743) Arduino Stackable Header - 8 Pin <https://www.sparkfun.com/products/9279> (PRT-09279) For SCREWTERMINALS and SPRING TERMINALS visit here: Screw Terimnals on SparkFun.com <https://www.sparkfun.com/search/results?term=Screw+Terminals> (5mm/3.5mm/2.54mm spacing) This device is also useful as a general connection point to wire up your design to another part of your project. Our various solder wires solder well into these plated through hole pads. Hook-Up Wire - Assortment (Stranded, 22 AWG) <https://www.sparkfun.com/products/11375> (PRT-11375) Hook-Up Wire - Assortment (Solid Core, 22 AWG) <https://www.sparkfun.com/products/11367> (PRT-11367) View the entire wire category on our website here <https://www.sparkfun.com/categories/141> Special notes: Molex polarized connector foot print use with SKU : PRT-08231 with associated crimp pins and housings. 1MM SMD Version SKU: PRT-10208 NOTES ON THE VARIANTS LOCK and LOCK_LONGPADS... This footprint was designed to help hold the alignment of a through-hole component (i.e. 6-pin header) while soldering it into place. You may notice that each hole has been shifted either up or down by 0.005 of an inch from it's more standard position (which is a perfectly straight line). This slight alteration caused the pins (the squares in the middle) to touch the edges of the holes. Because they are alternating, it causes a "brace" to hold the component in place. 0.005 has proven to be the perfect amount of "off-center" position when using our standard breakaway headers. Although looks a little odd when you look at the bare footprint, once you have a header in there, the alteration is very hard to notice. Also,if you push a header all the way into place, it is covered up entirely on the bottom side.; PROD_ID: CONN-08438
J20 = SparkFun-Displays:4DLCD-24-320X240: 4D LCD 4DLCD-24320240-IPS - 2.4" 240x320 TFT LCD 4-wire SPI capable TFT display. 36.72 x 48.96mm active area; PROD_ID: LCD-14913; PROD_ID1: CONN-14082
LS1 = SparkFun-Electromechanical:BUZZER: Buzzer Small round buzzers that operate around the audible 2kHz range. You can use these as speakers to create simple music or user interfaces. Variant Overview: PTH - Mini Speaker - PC Mount 12mm 2.048kHz <https://www.sparkfun.com/products/7950> PTH_KIT - Mini Speaker - PC Mount 12mm 2.048kHz <https://www.sparkfun.com/products/7950> KIT simplifies soldering by adding stop mask to one side of the pads. PTH_NO_SILK - Mini Speaker - PC Mount 12mm 2.048kHz <https://www.sparkfun.com/products/7950> No silkscreen indicator of buzzer outline. PTH_KIT_NO_SILK - Mini Speaker - PC Mount 12mm 2.048kHz <https://www.sparkfun.com/products/7950> KIT package w/o silkscreen SMD - Buzzer Audio Magnetic (CCV-084B16) SMD buzzer used on, e.g. the LilyPad Buzzer <https://www.sparkfun.com/products/8463> and RFID USB Reader <https://www.sparkfun.com/products/9963>. SMD_KIT - Buzzer Audio Magnetic (CCV-084B16) SMD Buzzer with elongated pins to make soldering easier. Used on the SparkFun Simon Says - Surface Mount Soldering Kit <https://www.sparkfun.com/products/10935>.; PROD_ID: COMP-08568
Q1 = SparkFun-DiscreteSemi:MOSFET_PCH: P-channel MOSFETs Voltage controlled devices that allow control of high current outputs. SparkFun Products: SparkFun ESP32 Thing <https://www.sparkfun.com/products/13907> SparkFun ESP8266 Thing <https://www.sparkfun.com/products/13231> SparkFun Pi Servo HAT V2 <https://www.sparkfun.com/products/15316> DMG2305UX-7 (20V/4.2A/SOT23-3); PROD_ID: TRANS-08285; VALUE: 1.1A/60V/600mΩ
Q2 = SparkFun-DiscreteSemi:TRANS_NPN: NPN transistor Current controlled devices typically used to amplify current or used as a switch. BC547 - COM-08928 <http://www.sparkfun.com/products/8928> (TO-92 45V 100mA) (1.Collector 2.Base 3.Emitter) 2N3904 - COM-00521 <http://www.sparkfun.com/products/521> (TO-92 40V 200mA) (1.Emitter 2.Base 3.Collector) P2N2222A - COM-12852 <http://www.sparkfun.com/products/12852> (TO-92 40V 600mA) (1.Collector 2.Base 3.Emitter); PROD_ID: TRANS-08049
R1 = SparkFun-Resistors:22KOHM: 22kΩ resistor A resistor is a passive two-terminal electrical component that implements electrical resistance as a circuit element. Resistors act to reduce current flow, and, at the same time, act to lower voltage levels within circuits. - Wikipedia; PROD_ID: RES-14281
R2 R3 = SparkFun-Resistors:5.1KOHM; PROD_ID: RES-12083
R4 = SparkFun-Resistors:33KOHM: 33kΩ resistor A resistor is a passive two-terminal electrical component that implements electrical resistance as a circuit element. Resistors act to reduce current flow, and, at the same time, act to lower voltage levels within circuits. - Wikipedia; PROD_ID: RES-15128
R5 R9 R14 R15 R19-R23 = SparkFun-Resistors:100KOHM: 100kΩ resistor A resistor is a passive two-terminal electrical component that implements electrical resistance as a circuit element. Resistors act to reduce current flow, and, at the same time, act to lower voltage levels within circuits. - Wikipedia; PROD_ID: RES-07828
R6 = SparkFun-Resistors:2.2KOHM: 2.2kΩ resistor A resistor is a passive two-terminal electrical component that implements electrical resistance as a circuit element. Resistors act to reduce current flow, and, at the same time, act to lower voltage levels within circuits. - Wikipedia; PROD_ID: RES-08272
R7 R11 R17 = SparkFun-Resistors:1KOHM: 1kΩ resistor A resistor is a passive two-terminal electrical component that implements electrical resistance as a circuit element. Resistors act to reduce current flow, and, at the same time, act to lower voltage levels within circuits. - Wikipedia; PROD_ID: RES-07856
R8 = SparkFun-Resistors:2.2KOHM: 2.2kΩ resistor A resistor is a passive two-terminal electrical component that implements electrical resistance as a circuit element. Resistors act to reduce current flow, and, at the same time, act to lower voltage levels within circuits. - Wikipedia; PROD_ID: RES-14341
R10 = SparkFun-Resistors:3.3KOHM: 3.3kΩ resistor A resistor is a passive two-terminal electrical component that implements electrical resistance as a circuit element. Resistors act to reduce current flow, and, at the same time, act to lower voltage levels within circuits. - Wikipedia; PROD_ID: RES-07851
R12 = SparkFun-Resistors:4.7KOHM: 4.7kΩ resistor A resistor is a passive two-terminal electrical component that implements electrical resistance as a circuit element. Resistors act to reduce current flow, and, at the same time, act to lower voltage levels within circuits. - Wikipedia; PROD_ID: RES-07857
R13 = SparkFun-Resistors:10KOHM: 10kΩ resistor A resistor is a passive two-terminal electrical component that implements electrical resistance as a circuit element. Resistors act to reduce current flow, and, at the same time, act to lower voltage levels within circuits. - Wikipedia; PROD_ID: RES-00824
R16 = SparkFun-Resistors:20KOHM: 20kΩ resistor A resistor is a passive two-terminal electrical component that implements electrical resistance as a circuit element. Resistors act to reduce current flow, and, at the same time, act to lower voltage levels within circuits. - Wikipedia; PROD_ID: RES-09383
R18 = rcl:R-EU_: RESISTOR, European symbol; SPICEPREFIX: R
R24 = SparkFun-Resistors:10OHM: 10Ω resistor A resistor is a passive two-terminal electrical component that implements electrical resistance as a circuit element. Resistors act to reduce current flow, and, at the same time, act to lower voltage levels within circuits. - Wikipedia; PROD_ID: RES-08705
S1-S4 = SparkFun-Switches:MOMENTARY-SWITCH-SPST: Momentary Switch (Pushbutton) - SPST Normally-open (NO) SPST momentary switches (buttons, pushbuttons). Variants PTH-12MM - 12mm square, through-hole Momentary Pushbutton Switch - 12mm Square <https://www.sparkfun.com/products/9190> (COM-09190) PTH-6.0MM, PTH-6.0MM-KIT - 6.0mm square, through-hole Mini Pushbutton Switch <https://www.sparkfun.com/products/97> (COM-00097) KIT package intended for soldering kit's - only one side of pads' copper is exposed. PTH-RIGHT-ANGLE-KIT - Right-angle, through-hole Right Angle Tactile Button <https://www.sparkfun.com/products/10791> - Used on SparkFun BigTime Watch Kit <https://www.sparkfun.com/products/11734> SMD-12MM - 12mm square, surface-mount Tactile Button - SMD (12mm) <https://www.sparkfun.com/products/12993> (COM-12993) Used on SparkFun PicoBoard <https://www.sparkfun.com/products/11888> SMD-4.5MM - 4.5mm Square Trackball Switch Used on SparkFun Blackberry Trackballer Breakout <https://www.sparkfun.com/products/13169> SMD-4.6MMX2.8MM - 4.60mm x 2.80mm, surface mount Used on SparkFun SAMD21 Mini Breakout <https://www.sparkfun.com/products/13664> SMD-5.2MM, SMD-5.2-REDUNDANT - 5.2mm square, surface-mount Mini Pushbutton Switch - SMD <https://www.sparkfun.com/products/8720> (COM-08720) Used on Arduino Pro Mini <https://www.sparkfun.com/products/11114> REDUNDANT package connects both switch circuits together SMD-6.0X3.5MM - 6.0 x 3.5mm, surface mount Momentary Reset Switch SMD <https://www.sparkfun.com/products/8229> (COM-08229) SMD-6.2MM-TALL - 6.2mm square, surface mount Tactile Button - SMD (6mm) <https://www.sparkfun.com/products/12992> Used on SparkFun Digital Sandbox <https://www.sparkfun.com/products/12651> SMD-RIGHT-ANGLE - Right-angle, surface mount Used on SparkFun Block for Intel® Edison - Arduino <https://www.sparkfun.com/products/13036>; PROD_ID: SWCH-14139
S6 = SparkFun-Switches:JOYSTICK_MINI: Small Tactile Joystick w/ Select Switch A 5-way tactile switch allows for a joystick-like interface in a very small package. Part #: 4UCON SF303GJ26 SparkFun Products 5-way Tactile Switch <https://www.sparkfun.com/products/10063> (COM-10063) Used on SparkFun Block for Intel® Edison - OLED <https://www.sparkfun.com/products/13035> (DEV-13035) Used on CAN-BUS Shield <https://www.sparkfun.com/products/13262> (DEV-13262); PROD_ID: SWCH-09905; SF_SKU: COM-10063
TP1 = SparkFun-Connectors:TEST-POINT: SparkFun Test Points Bare copper test points for troubleshooting or In-Circuit-Testing. These are used by our Production team for verifying production board runs using pogo-pins on test beds. SparkFun Products: SparkFun LSM9DS1 Breakout <https://www.sparkfun.com/products/13284> SparkFun PSOC <https://www.sparkfun.com/products/13714> SparkFun Load Cell Amplifier <https://www.sparkfun.com/products/13879>
U2 = SparkFun-IC-Power:MCP73831: MCP73831T Li-Ion, Li-Pol Controller Miniature single cell, fully integrated Li-Ion, Li-polymer charge management controller Datasheet <http://ww1.microchip.com/downloads/en/DeviceDoc/20001984g.pdf> SparkFun Products: SparkFun ESP32 Thing <https://www.sparkfun.com/products/13907> SparkFun 9DoF Razor IMU M0 <https://www.sparkfun.com/products/14001>; PROD_ID: IC-09995
U3 = SparkFun-IC-Microcontroller:ATMEGA328P_PDIP: Atmel 328P Through hole ATMEGA328P uC used in the Arduino 32kb flash, 1k EEPROM, 2k SRAM Datasheet <http://www.sparkfun.com/datasheets/Components/SMD/ATMega328.pdf> SparkFun Products Storefront component: AVR 28 Pin 20MHz 32K 6A/D - ATMega328P <https://www.sparkfun.com/products/9061> (COM-09061) SparkFun Simon Says - Through-Hole Soldering Kit <https://www.sparkfun.com/products/10547> (KIT-10547) SparkFun Learn to Solder - Simon Says <https://www.sparkfun.com/products/13708> (KIT-13708) SparkFun BigTime Watch Kit <https://www.sparkfun.com/products/11734> (KIT-11734) SparkFun ClockIt <https://www.sparkfun.com/products/10930> (KIT-10930) SparkFun Serial Enabled LCD Kit <https://www.sparkfun.com/products/10097> (LCD-10097) SparkFun Simon Tilts - Through Hole Soldering Kit <https://www.sparkfun.com/products/12634> (KIT-12634) SparkFun Frequency Counter Kit <https://www.sparkfun.com/products/10140> (KIT-10140) FabFM Radio Kit <https://www.sparkfun.com/products/11043> (KIT-11043) SparkFun Binary Blaster Kit <https://www.sparkfun.com/products/12037> (KIT-12037) SparkFun Metro-Gnome <https://www.sparkfun.com/products/9236> (KIT-09236) ATmega328 with Arduino Optiboot (Uno) <https://www.sparkfun.com/products/10524> (DEV-10524); PROD_ID: IC-09136; VALUE: 328P
U4 = SparkFun-IC-Power:V_REG_AP2112: AP2112 - 600mA CMOS LDO Regulator w/ Enable The AP2112 is CMOS process low dropout linear regulator with enable function, the regulator delivers a guaranteed 600mA (min.) continuous load current. Features Output Voltage Accuracy: ±1.5% Output Current: 600mA (Min.) Foldback Short Current Protection: 50mA Enable Function to Turn ON/OFF VOUT Low Dropout Voltage (3.3V): 250mV (Typ.) @IOUT=600mA Excellent Load Regulation: 0.2%/A (Typ.) Excellent Line Regulation: 0.02%/V (Typ.) Low Quiescent Current: 55μA (Typ.) Low Standby Current: 0.01μA (Typ.) Low Output Noise: 50μVRMS PSRR: 100Hz -65dB, 1kHz -65dB OTSD Protection Stable with 1.0μF Flexible Cap: Ceramic, Tantalum and Aluminum Electrolytic Operation Temperature Range: -40°C to 85°C ESD: MM 400V, HBM 4000V; PROD_ID: VREG-12457
U5 = SparkFun-IC-Power:AP7361C-33FGE: AP7361C 3.3V LDO Regulator; PROD_ID: VREG-14094
U6 = SparkFun-IC-Comms:CP2102N; PROD_ID: IC-14020
Y1 = SparkFun-Clocks:CRYSTAL-16MHZ: 16MHz Crystal Digikey Example <http://www.digikey.com/product-search/en?keywords=535-9122-1-ND> Frequency: 16MHz Frequency Stability: ±50ppm Frequency Tolerance: ±20ppm Load Capacitance: 18pF SparkFun Products: Pro Micro -5V/16MHz <https://www.sparkfun.com/products/12640> SparkFun Serial Enabled LCD Kit <https://www.sparkfun.com/products/10097>; PROD_ID: XTAL-08181; SF_ID: COM-00536